# Altium schematic sheet SPI.SchDoc
size 199 x 200 mm; SheetNumber: 11; SheetTotal: 13
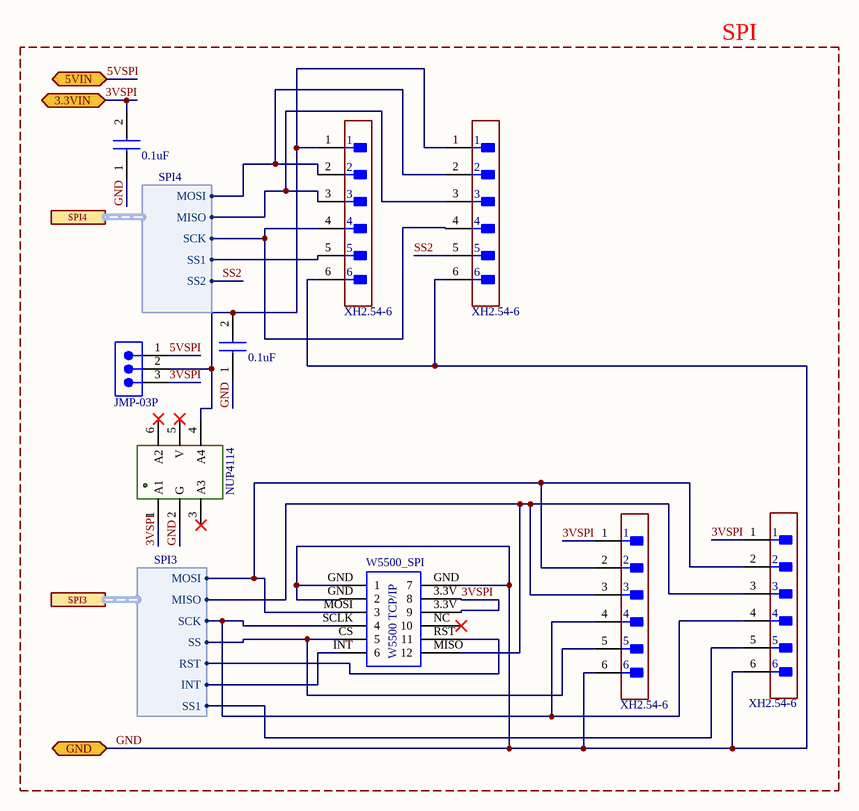
[diagram p0: SPI.SchDoc]

## Parts
CAPSPI3  0.1uF  [CAP0805]
CAPSPI4  0.1uF  [CAP0805]
JMPSPI  JMP-03P  [JMP-03P]
NUPSPI  NUP4114  [NUP4114]
SPI3-1  XH2.54-6  [XH2.54-6]
SPI3-2  XH2.54-6  [XH2.54-6]
SPI4-1  XH2.54-6  [XH2.54-6]
SPI4-2  XH2.54-6  [XH2.54-6]
W5500SPI  W5500_SPI  [W5500]

## Blocks framed on the sheet
SPI: CAPSPI3 CAPSPI4 JMPSPI NUPSPI SPI3-1 SPI3-2 SPI4-1 SPI4-2 W5500SPI

## Ports
3.3VIN (bidir, see CONTROL_PCB_MAIN[5C], ADC1[2B], I2C[2A], I_O[1A], MOTORS[2B], RELAY_5V_3.3V_LEVEL[3B], UARTSTM[2A]), 5VIN (bidir, see CONTROL_PCB_MAIN[5C], ADC1[2B], I2C[2A], I_O[1A], LEDS[1A], MOTORS[2B], RELAY_5V_3.3V_LEVEL[3B], UARTSTM[2A]), GND (bidir, see CONTROL_PCB_MAIN[5D], ADC1[2D], CAN[2C], I2C[2D], I_O[1C], LEDS[1D], MOTORS[2D], RELAY_5V_3.3V_LEVEL[5C], RELAY_12VV_VDD_LEVEL[5B], STM32[1D], UARTSTM[2D]), SPI3 (harness SPI3, see CONTROL_PCB_MAIN[5D], STM32[2C]), SPI4 (harness SPI4, see CONTROL_PCB_MAIN[5D], STM32[2C])

## Harnesses
SPI3: MISO, MOSI, SCK, SS, RST, INT, SS1
SPI4: MISO, MOSI, SCK, SS1, SS2

## Nets
3VSPI: CAPSPI3.2 JMPSPI.3 NUPSPI.1(A1) SPI3-1.1 SPI3-2.1 W5500SPI.3.3V(8) ; port 3.3VIN
5VSPI: JMPSPI.1 ; port 5VIN
GND: CAPSPI3.1 CAPSPI4.1 NUPSPI.2(G) SPI3-1.6 SPI3-2.6 SPI4-1.6 SPI4-2.6 W5500SPI.GND(1) ; port GND
SS2: SPI4-2.5 ; port SPI4.SS2
NetCAPSPI4_2: CAPSPI4.2 JMPSPI.2 NUPSPI.4(A4) SPI4-1.1 SPI4-2.1
NetSPI3-1_2: SPI3-1.2 SPI3-2.2 W5500SPI.MOSI(3) ; port SPI3.MOSI
NetSPI3-1_3: SPI3-1.3 SPI3-2.3 W5500SPI.MISO(12) ; port SPI3.MISO
NetSPI3-1_4: SPI3-1.4 SPI3-2.4 W5500SPI.SCLK(4) ; port SPI3.SCK
NetSPI3-1_5: SPI3-1.5 W5500SPI.CS(5) ; port SPI3.SS
NetSPI3-2_5: SPI3-2.5 ; port SPI3.SS1
NetSPI4-1_2: SPI4-1.2 SPI4-2.2 ; port SPI4.MOSI
NetSPI4-1_3: SPI4-1.3 SPI4-2.3 ; port SPI4.MISO
NetSPI4-1_4: SPI4-1.4 SPI4-2.4 ; port SPI4.SCK
NetSPI4-1_5: SPI4-1.5 ; port SPI4.SS1
NetW5500SPI_INT: W5500SPI.INT(6) ; port SPI3.INT
NetW5500SPI_RST: W5500SPI.RST(11) ; port SPI3.RST

Not connected (* = marked no-connect by the designer): NUPSPI 3(A3)* 5(V)* 6(A2)*; W5500SPI NC(10)*

## Library data of the parts
CAPSPI3 CAPSPI4 = CAP0805: CAP-SMD0805
JMPSPI = JMP-03P: PLS-1x3
NUPSPI = NUP4114: NUP4114HMR6T1G
SPI3-1 SPI3-2 SPI4-1 SPI4-2 = XH2.54-6: JST XH2.54-5pin
W5500SPI = W5500: W5500 TCP/IP